# EAGLE schematic p8x-control-card (EAGLE 9.6.2)
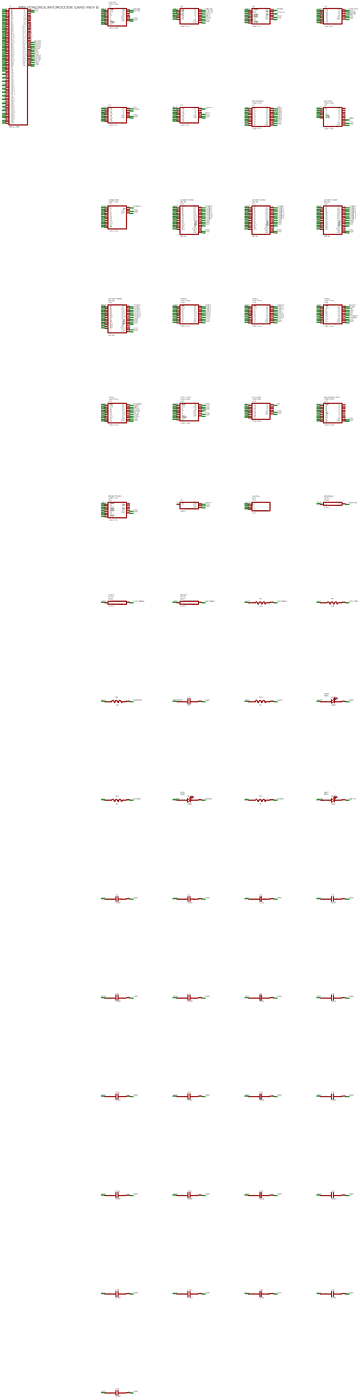
[diagram p0: schematic, sheet 1, overview]
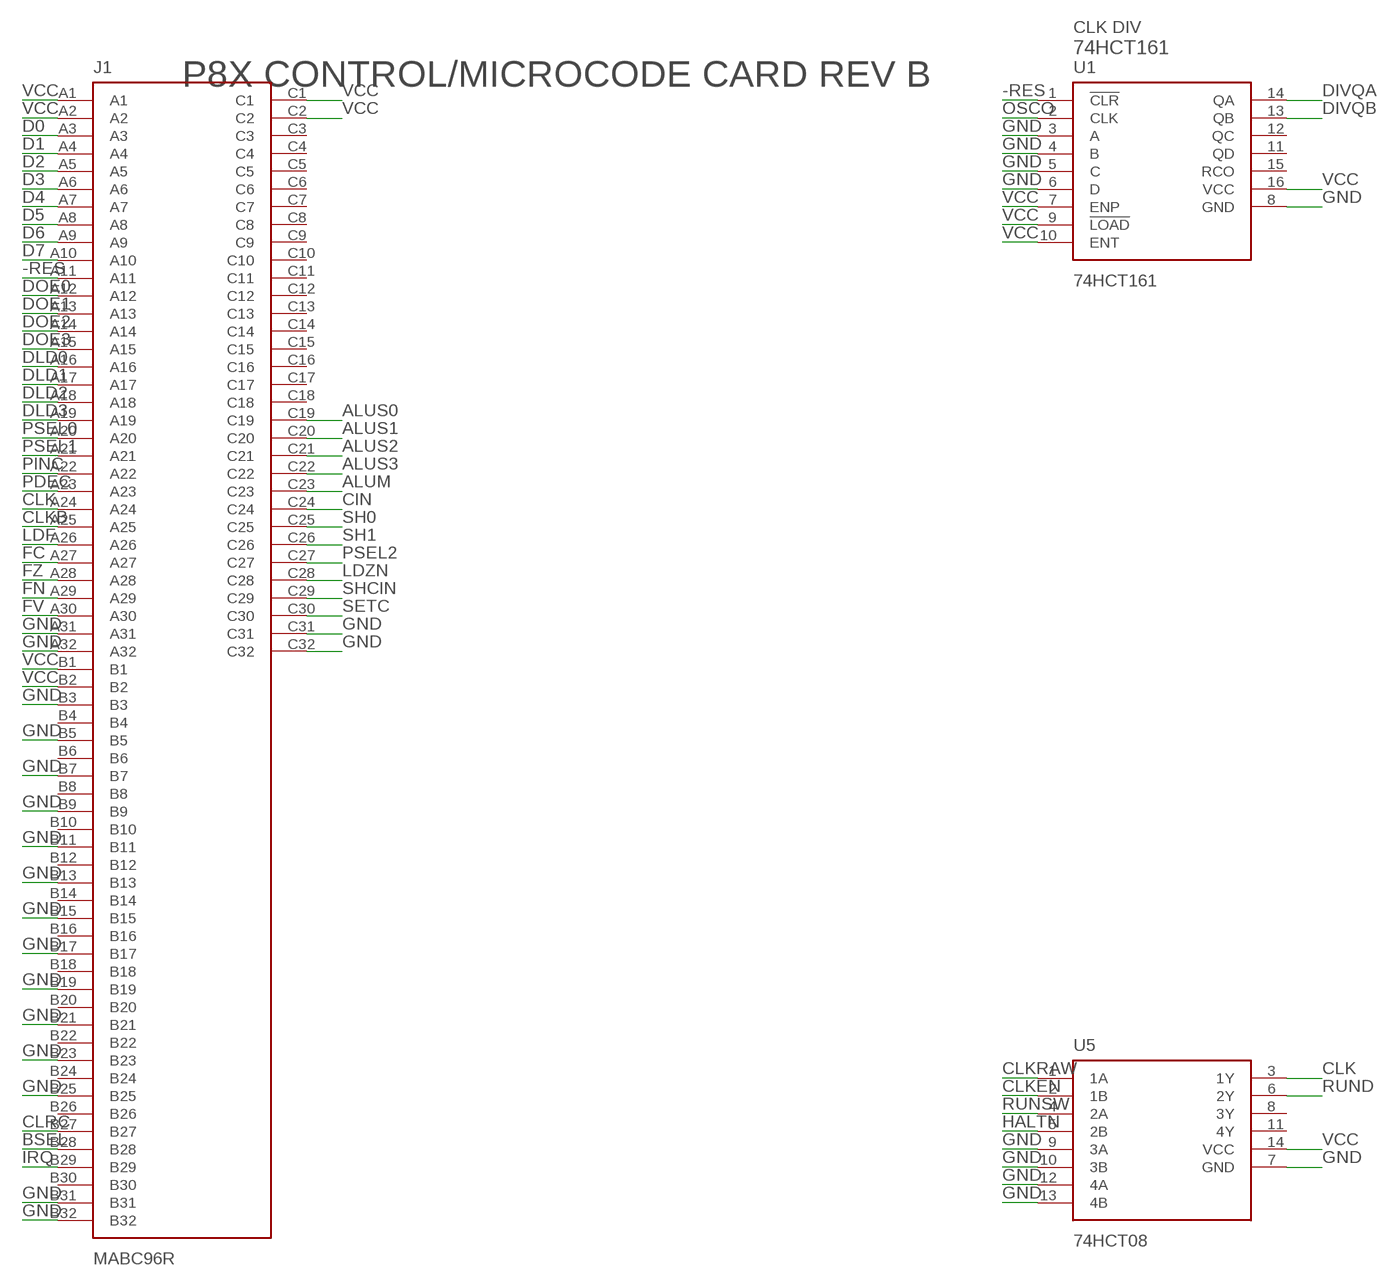
[diagram p1: schematic, sheet 1, part 1 of 6]
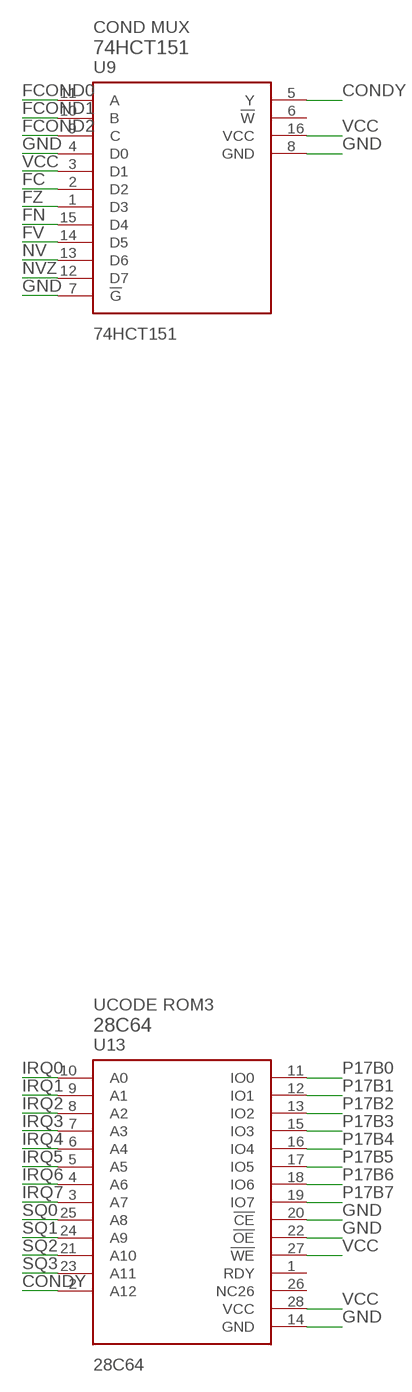
[diagram p2: schematic, sheet 1, part 2 of 6]
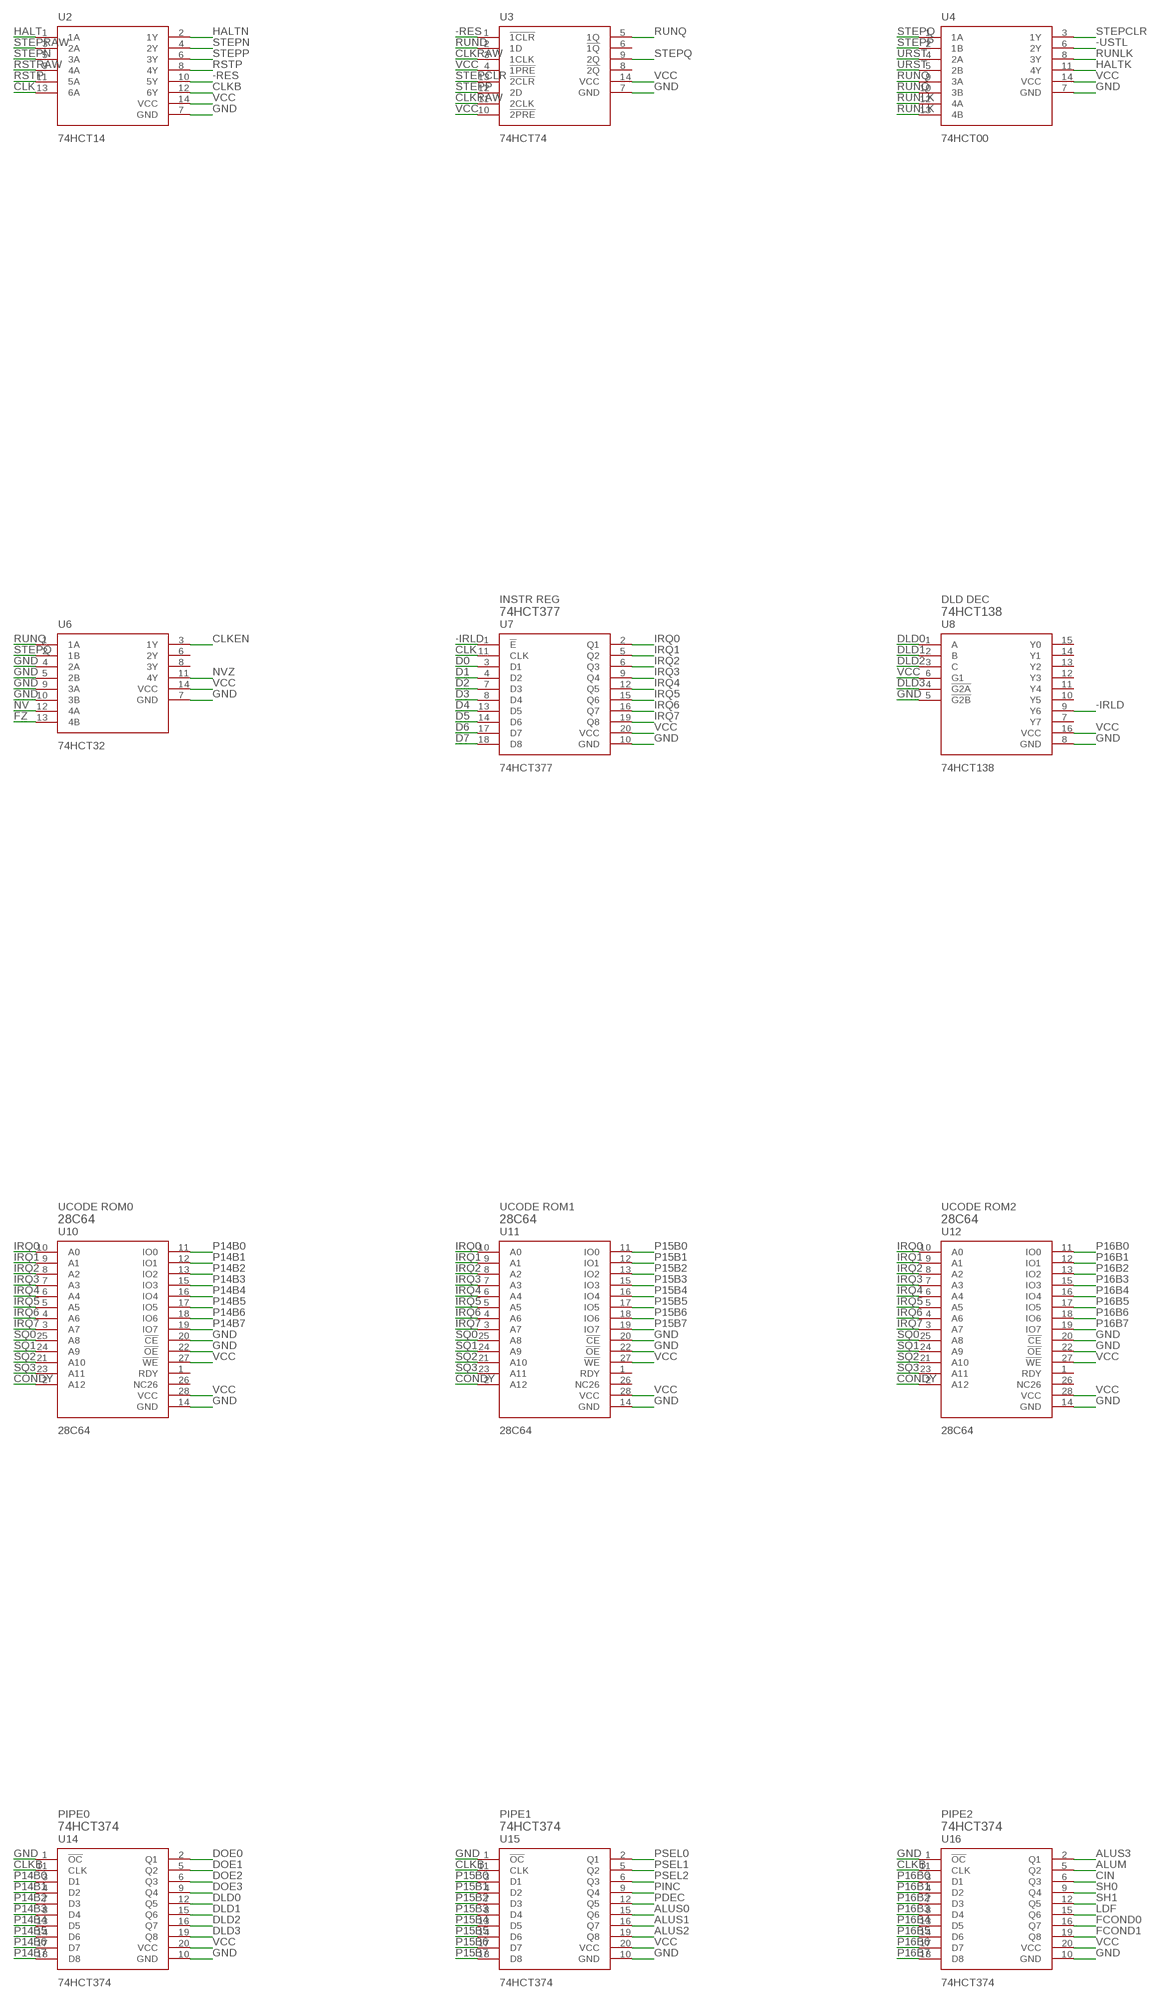
[diagram p3: schematic, sheet 1, part 3 of 6]
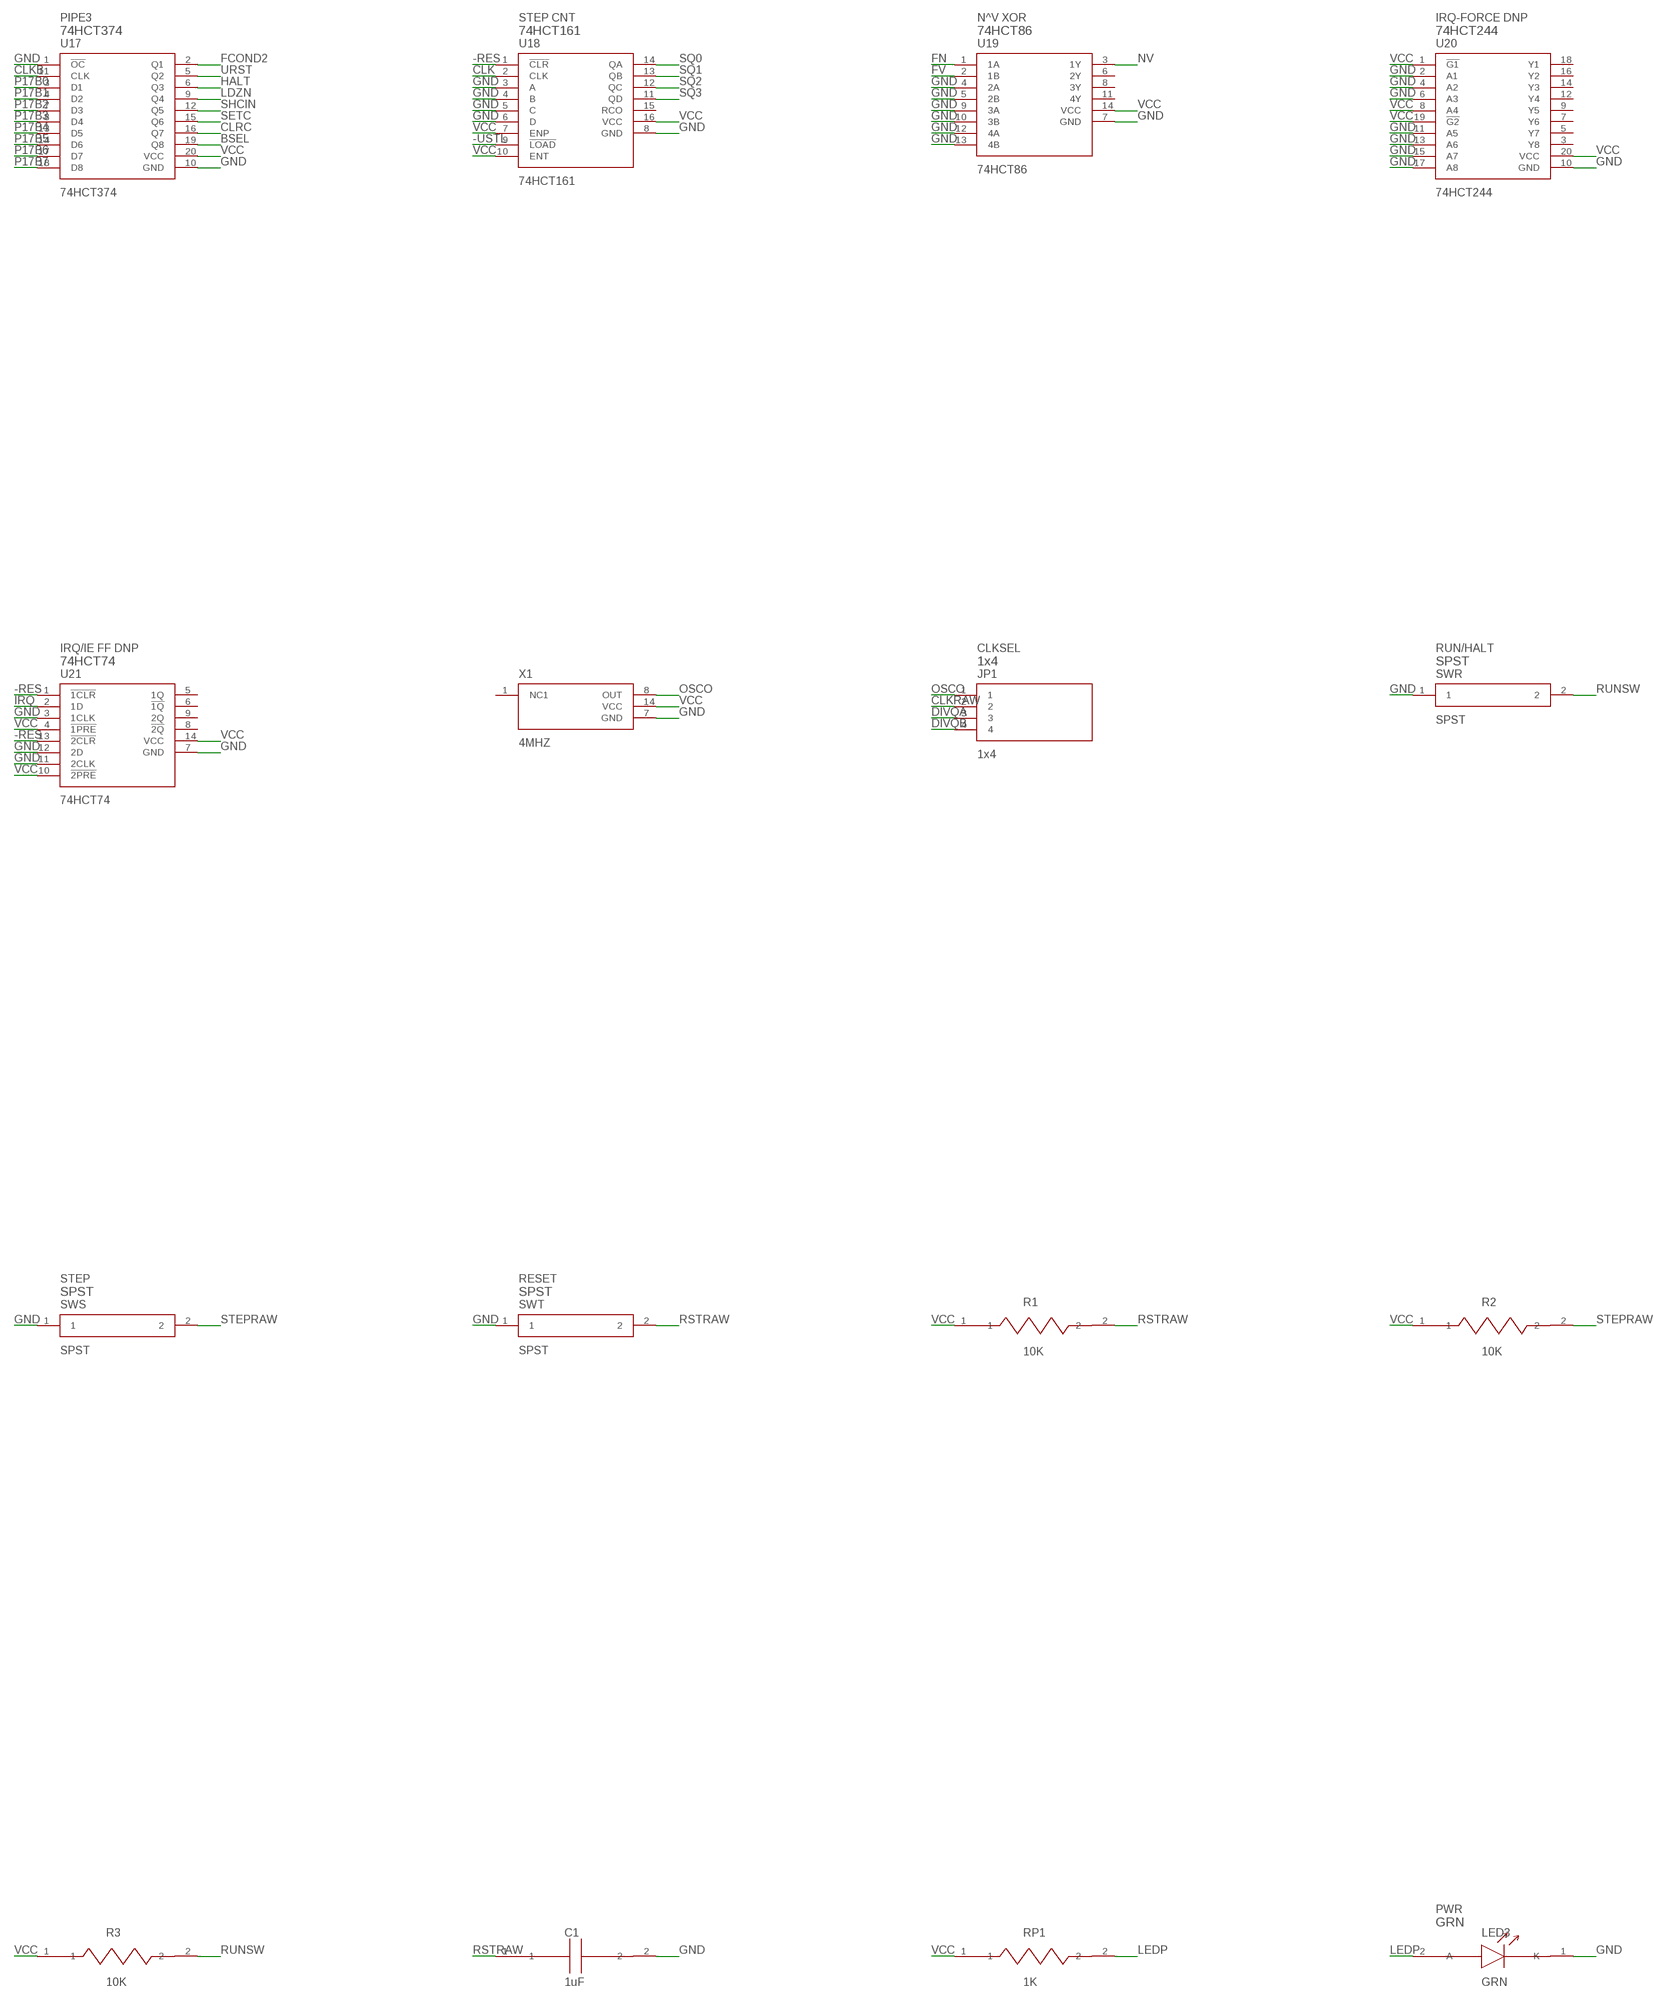
[diagram p4: schematic, sheet 1, part 4 of 6]
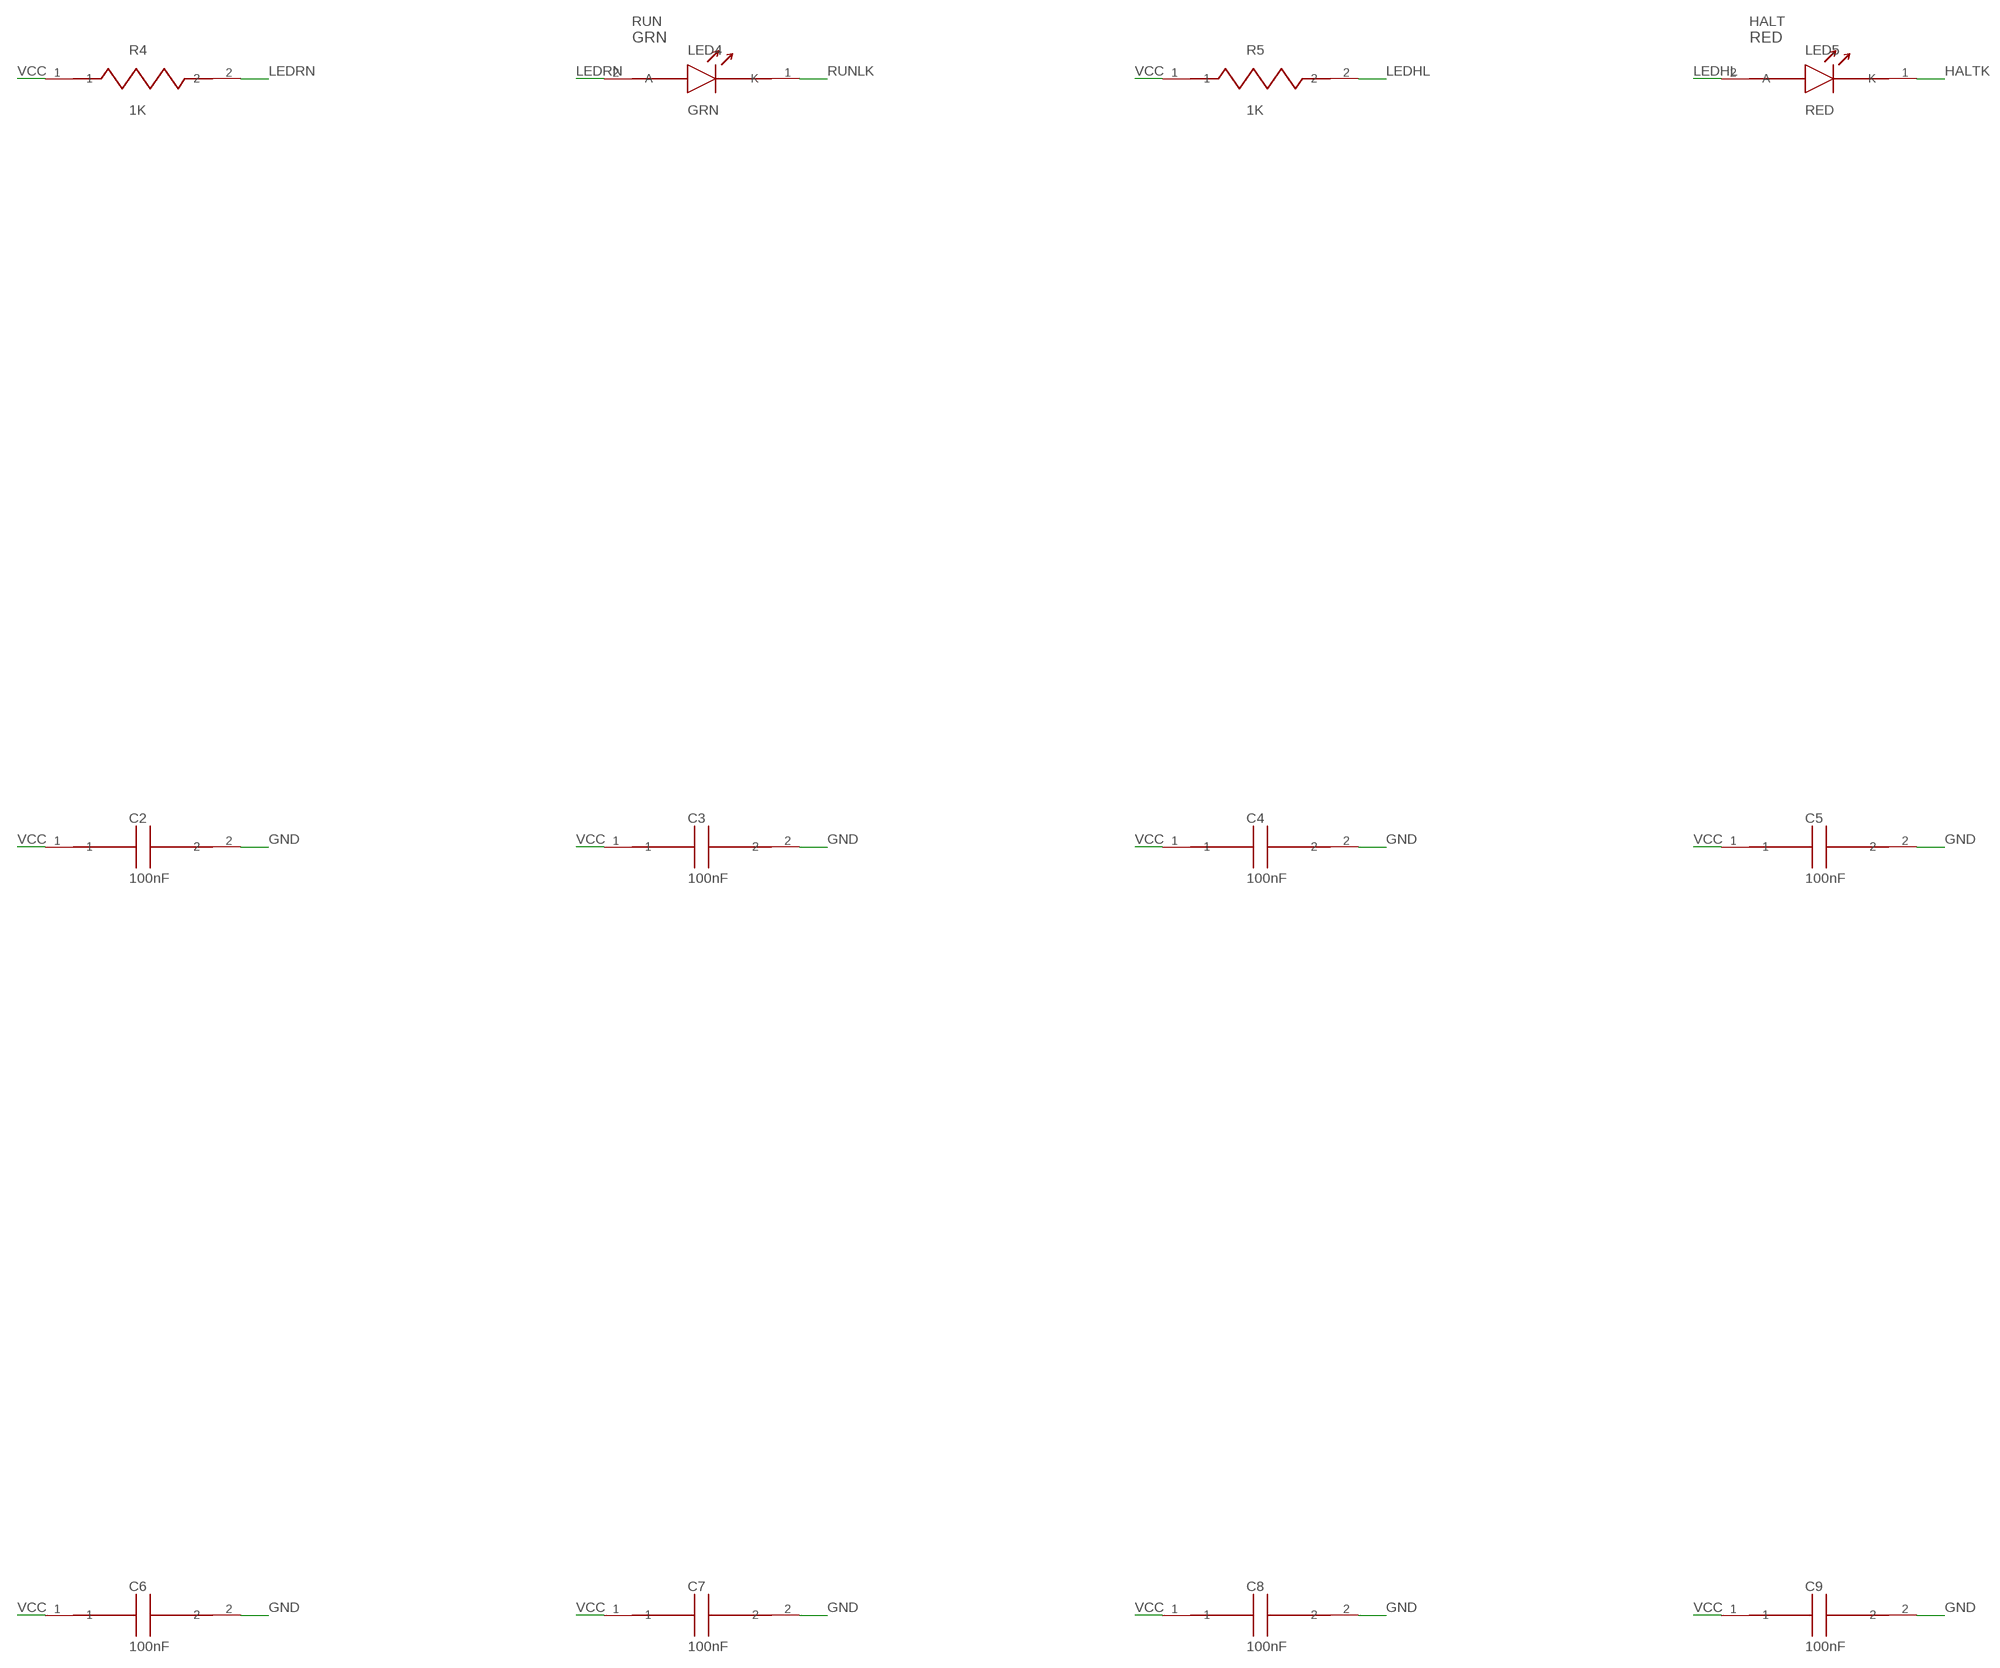
[diagram p5: schematic, sheet 1, part 5 of 6]
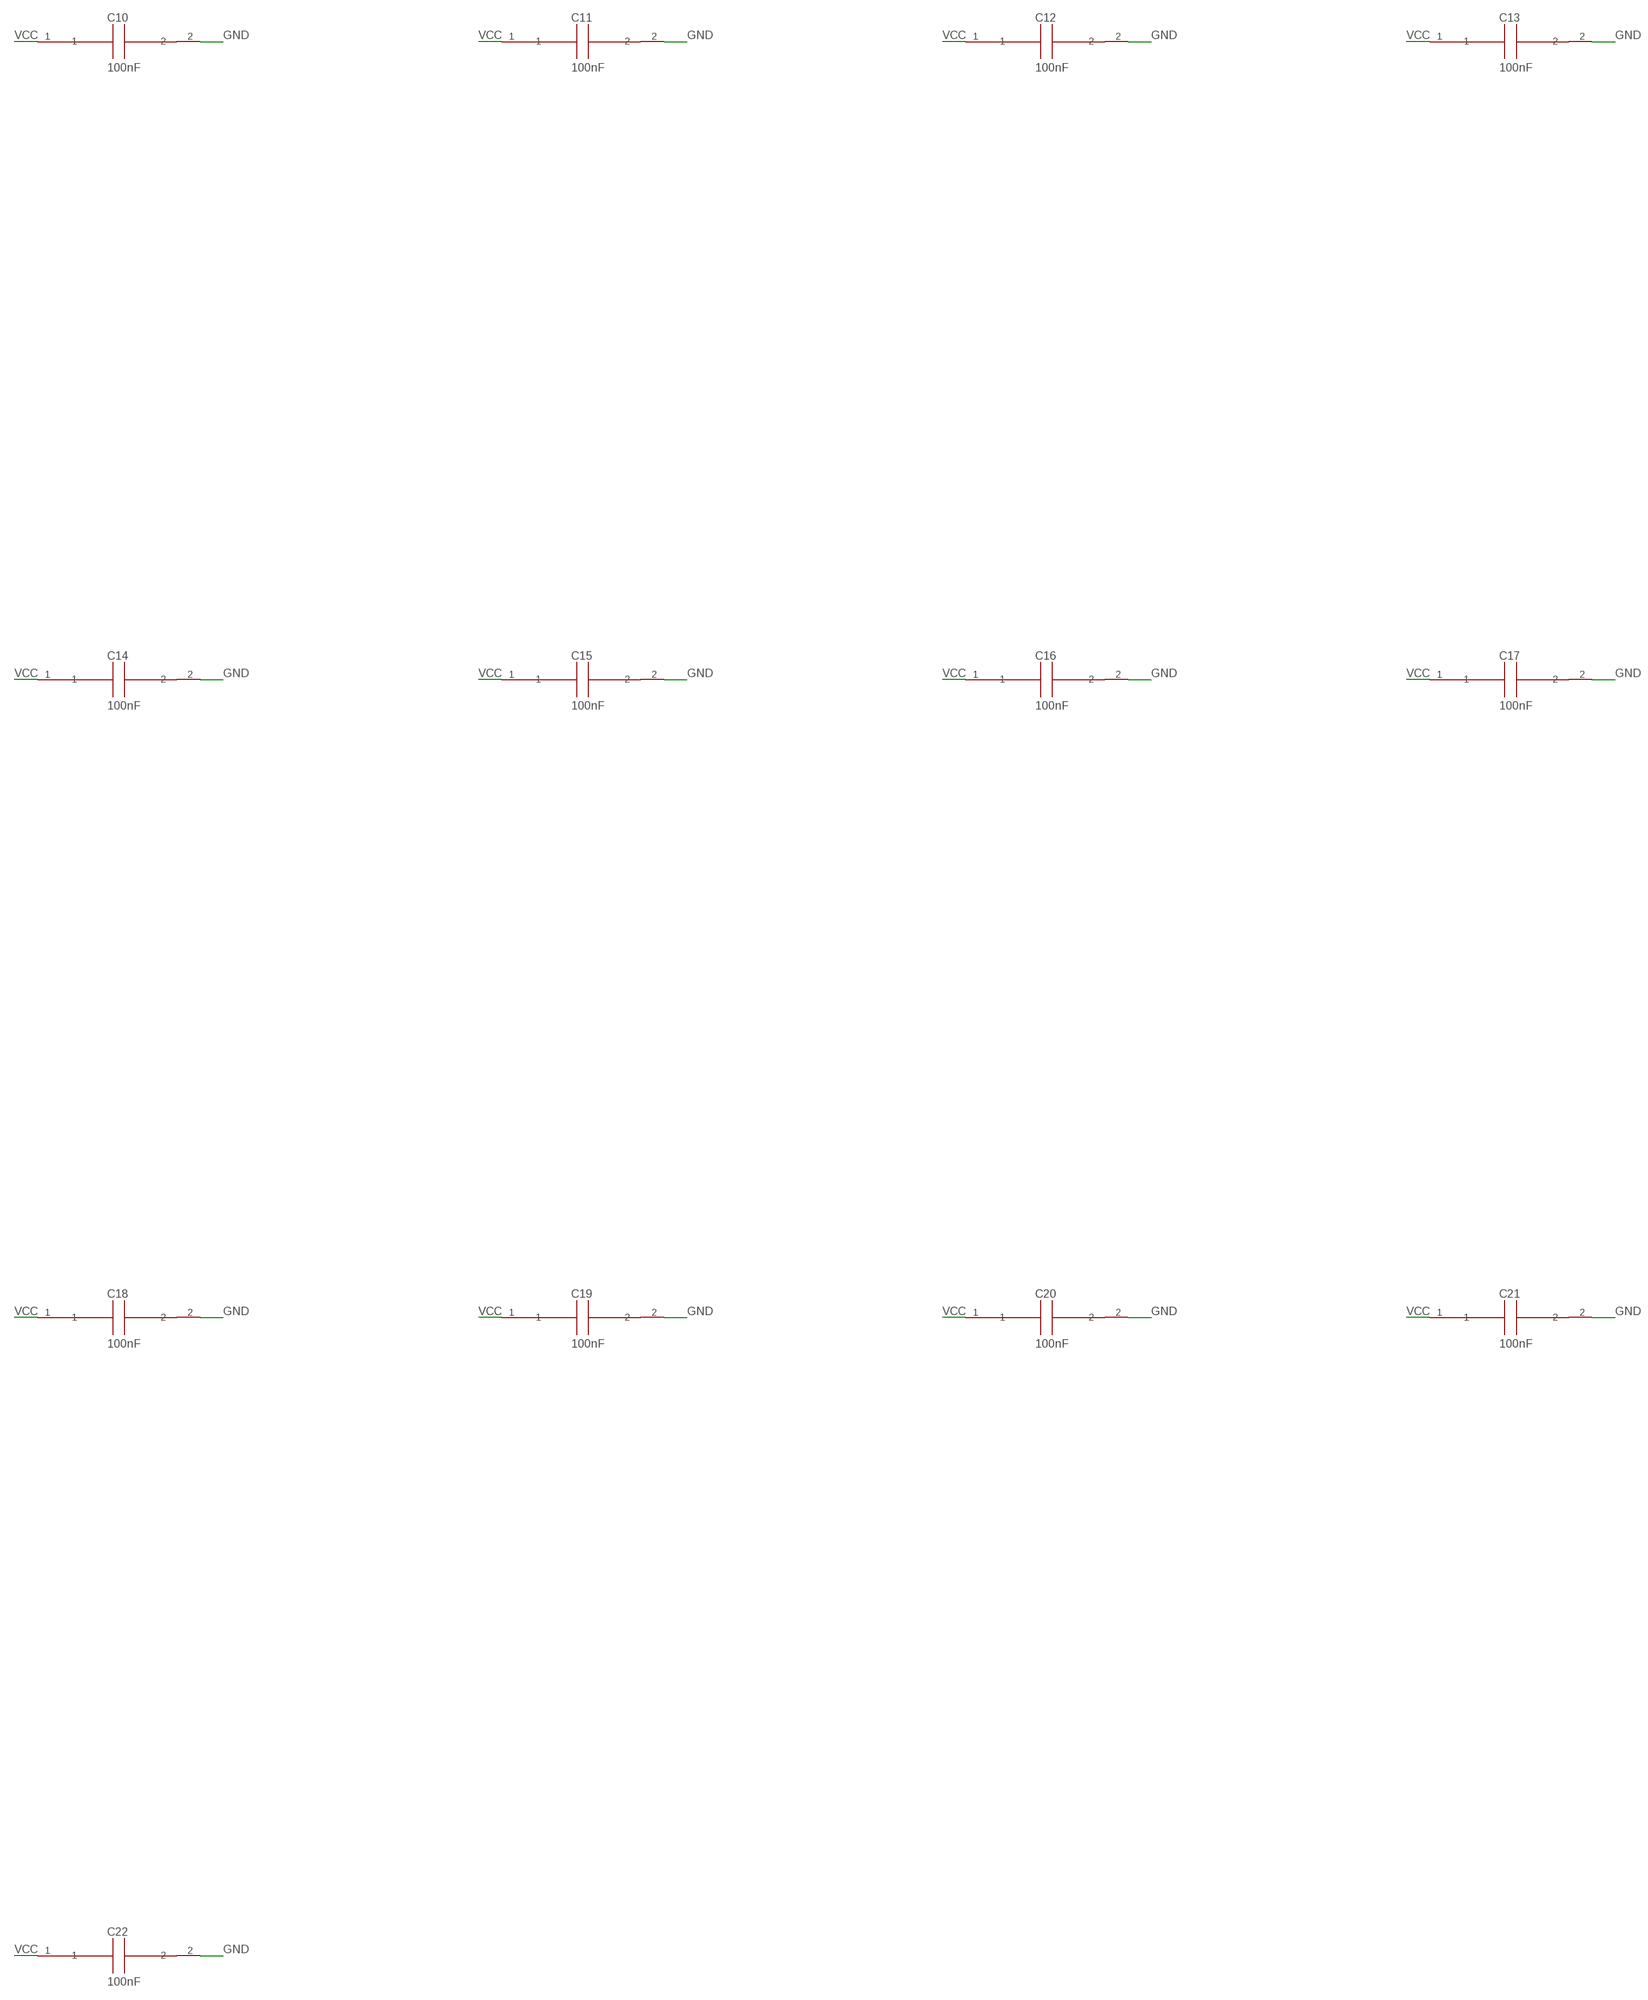
[diagram p6: schematic, sheet 1, part 6 of 6]

## Parts
C1  1uF  CAP  [C_DISC]
C2  100nF  CAP1  [C_DISC1]
C3  100nF  CAP1  [C_DISC1]
C4  100nF  CAP1  [C_DISC1]
C5  100nF  CAP1  [C_DISC1]
C6  100nF  CAP1  [C_DISC1]
C7  100nF  CAP1  [C_DISC1]
C8  100nF  CAP1  [C_DISC1]
C9  100nF  CAP1  [C_DISC1]
C10  100nF  CAP1  [C_DISC1]
C11  100nF  CAP1  [C_DISC1]
C12  100nF  CAP1  [C_DISC1]
C13  100nF  CAP1  [C_DISC1]
C14  100nF  CAP1  [C_DISC1]
C15  100nF  CAP1  [C_DISC1]
C16  100nF  CAP1  [C_DISC1]
C17  100nF  CAP1  [C_DISC1]
C18  100nF  CAP1  [C_DISC1]
C19  100nF  CAP1  [C_DISC1]
C20  100nF  CAP1  [C_DISC1]
C21  100nF  CAP1  [C_DISC1]
C22  100nF  CAP1  [C_DISC1]
J1  MABC96R  DIN96C  [MABC96R]
JP1  1x4  HDR4  [HDR4]
LED3  GRN  LED  [LED5]
LED4  GRN  LED  [LED5]
LED5  RED  LED  [LED5]
R1  10K  RES  [R_AXIAL]
R2  10K  RES  [R_AXIAL]
R3  10K  RES  [R_AXIAL]
R4  1K  RES  [R_AXIAL]
R5  1K  RES  [R_AXIAL]
RP1  1K  RES  [R_AXIAL]
SWR  SPST  SW2  [SW2P]
SWS  SPST  SW2  [SW2P]
SWT  SPST  SW2  [SW2P]
U1  74HCT161  74161  [DIP16]
U2  74HCT14  HEX14  [DIP14]
U3  74HCT74  7474  [DIP14]
U4  74HCT00  GATES14  [DIP14]
U5  74HCT08  GATES14  [DIP14]
U6  74HCT32  GATES14  [DIP14]
U7  74HCT377  74377V2  [DIP20]
U8  74HCT138  74138  [DIP16]
U9  74HCT151  74151  [DIP16]
U10  28C64  [DIP28W]
U11  28C64  [DIP28W]
U12  28C64  [DIP28W]
U13  28C64  [DIP28W]
U14  74HCT374  74374  [DIP20]
U15  74HCT374  74374  [DIP20]
U16  74HCT374  74374  [DIP20]
U17  74HCT374  74374  [DIP20]
U18  74HCT161  74161  [DIP16]
U19  74HCT86  GATES14  [DIP14]
U20  74HCT244  74244  [DIP20]
U21  74HCT74  7474  [DIP14]
X1  4MHZ  OSC  [OSC4]

## Nets
-IRLD: U7.1(!E) U8.9(Y6)
-RES: J1.A11 U1.1(!CLR) U2.10(5Y) U3.1(!1CLR) U18.1(!CLR) U21.1(!1CLR) U21.13(!2CLR)
-USTL: U4.6(2Y) U18.9(!LOAD)
ALUM: J1.C23 U16.5(Q2)
ALUS0: J1.C19 U15.15(Q6)
ALUS1: J1.C20 U15.16(Q7)
ALUS2: J1.C21 U15.19(Q8)
ALUS3: J1.C22 U16.2(Q1)
BSEL: J1.B28 U17.19(Q8)
CIN: J1.C24 U16.6(Q3)
CLK: J1.A24 U2.13(6A) U5.3(1Y) U7.11(CLK) U18.2(CLK)
CLKB: J1.A25 U2.12(6Y) U14.11(CLK) U15.11(CLK) U16.11(CLK) U17.11(CLK)
CLKEN: U5.2(1B) U6.3(1Y)
CLKRAW: JP1.2 U3.3(1CLK) U3.11(2CLK) U5.1(1A)
CLRC: J1.B27 U17.16(Q7)
CONDY: U9.5(Y) U10.2(A12) U11.2(A12) U12.2(A12) U13.2(A12)
D0: J1.A3 U7.3(D1)
D1: J1.A4 U7.4(D2)
D2: J1.A5 U7.7(D3)
D3: J1.A6 U7.8(D4)
D4: J1.A7 U7.13(D5)
D5: J1.A8 U7.14(D6)
D6: J1.A9 U7.17(D7)
D7: J1.A10 U7.18(D8)
DIVQA: JP1.3 U1.14(QA)
DIVQB: JP1.4 U1.13(QB)
DLD0: J1.A16 U8.1(A) U14.12(Q5)
DLD1: J1.A17 U8.2(B) U14.15(Q6)
DLD2: J1.A18 U8.3(C) U14.16(Q7)
DLD3: J1.A19 U8.4(!G2A) U14.19(Q8)
DOE0: J1.A12 U14.2(Q1)
DOE1: J1.A13 U14.5(Q2)
DOE2: J1.A14 U14.6(Q3)
DOE3: J1.A15 U14.9(Q4)
FC: J1.A27 U9.2(D2)
FCOND0: U9.11(A) U16.16(Q7)
FCOND1: U9.10(B) U16.19(Q8)
FCOND2: U9.9(C) U17.2(Q1)
FN: J1.A29 U9.15(D4) U19.1(1A)
FV: J1.A30 U9.14(D5) U19.2(1B)
FZ: J1.A28 U6.13(4B) U9.1(D3)
GND: C1.2 C2.2 C3.2 C4.2 C5.2 C6.2 C7.2 C8.2 C9.2 C10.2 C11.2 C12.2 C13.2 C14.2 C15.2 C16.2 C17.2 C18.2 C19.2 C20.2 C21.2 C22.2 J1.A31 J1.A32 J1.B3 J1.B5 J1.B7 J1.B9 J1.B11 J1.B13 J1.B15 J1.B17 J1.B19 J1.B21 J1.B23 J1.B25 J1.B31 J1.B32 J1.C31 J1.C32 LED3.1(K) SWR.1 SWS.1 SWT.1 U1.3(A) U1.4(B) U1.5(C) U1.6(D) U1.8(GND) U2.7(GND) U3.7(GND) U4.7(GND) U5.7(GND) U5.9(3A) U5.10(3B) U5.12(4A) U5.13(4B) U6.4(2A) U6.5(2B) U6.7(GND) U6.9(3A) U6.10(3B) U7.10(GND) U8.5(!G2B) U8.8(GND) U9.4(D0) U9.7(!G) U9.8(GND) U10.14(GND) U10.20(!CE) U10.22(!OE) U11.14(GND) U11.20(!CE) U11.22(!OE) U12.14(GND) U12.20(!CE) U12.22(!OE) U13.14(GND) U13.20(!CE) U13.22(!OE) U14.1(!OC) U14.10(GND) U15.1(!OC) U15.10(GND) U16.1(!OC) U16.10(GND) U17.1(!OC) U17.10(GND) U18.3(A) U18.4(B) U18.5(C) U18.6(D) U18.8(GND) U19.4(2A) U19.5(2B) U19.7(GND) U19.9(3A) U19.10(3B) U19.12(4A) U19.13(4B) U20.2(A1) U20.4(A2) U20.6(A3) U20.10(GND) U20.11(A5) U20.13(A6) U20.15(A7) U20.17(A8) U21.3(1CLK) U21.7(GND) U21.11(2CLK) U21.12(2D) X1.7(GND)
HALT: U2.1(1A) U17.6(Q3)
HALTK: LED5.1(K) U4.11(4Y)
HALTN: U2.2(1Y) U5.5(2B)
IRQ: J1.B29 U21.2(1D)
IRQ0: U7.2(Q1) U10.10(A0) U11.10(A0) U12.10(A0) U13.10(A0)
IRQ1: U7.5(Q2) U10.9(A1) U11.9(A1) U12.9(A1) U13.9(A1)
IRQ2: U7.6(Q3) U10.8(A2) U11.8(A2) U12.8(A2) U13.8(A2)
IRQ3: U7.9(Q4) U10.7(A3) U11.7(A3) U12.7(A3) U13.7(A3)
IRQ4: U7.12(Q5) U10.6(A4) U11.6(A4) U12.6(A4) U13.6(A4)
IRQ5: U7.15(Q6) U10.5(A5) U11.5(A5) U12.5(A5) U13.5(A5)
IRQ6: U7.16(Q7) U10.4(A6) U11.4(A6) U12.4(A6) U13.4(A6)
IRQ7: U7.19(Q8) U10.3(A7) U11.3(A7) U12.3(A7) U13.3(A7)
LDF: J1.A26 U16.15(Q6)
LDZN: J1.C28 U17.9(Q4)
LEDHL: LED5.2(A) R5.2
LEDP: LED3.2(A) RP1.2
LEDRN: LED4.2(A) R4.2
NV: U6.12(4A) U9.13(D6) U19.3(1Y)
NVZ: U6.11(4Y) U9.12(D7)
OSCO: JP1.1 U1.2(CLK) X1.8(OUT)
P14B0: U10.11(IO0) U14.3(D1)
P14B1: U10.12(IO1) U14.4(D2)
P14B2: U10.13(IO2) U14.7(D3)
P14B3: U10.15(IO3) U14.8(D4)
P14B4: U10.16(IO4) U14.13(D5)
P14B5: U10.17(IO5) U14.14(D6)
P14B6: U10.18(IO6) U14.17(D7)
P14B7: U10.19(IO7) U14.18(D8)
P15B0: U11.11(IO0) U15.3(D1)
P15B1: U11.12(IO1) U15.4(D2)
P15B2: U11.13(IO2) U15.7(D3)
P15B3: U11.15(IO3) U15.8(D4)
P15B4: U11.16(IO4) U15.13(D5)
P15B5: U11.17(IO5) U15.14(D6)
P15B6: U11.18(IO6) U15.17(D7)
P15B7: U11.19(IO7) U15.18(D8)
P16B0: U12.11(IO0) U16.3(D1)
P16B1: U12.12(IO1) U16.4(D2)
P16B2: U12.13(IO2) U16.7(D3)
P16B3: U12.15(IO3) U16.8(D4)
P16B4: U12.16(IO4) U16.13(D5)
P16B5: U12.17(IO5) U16.14(D6)
P16B6: U12.18(IO6) U16.17(D7)
P16B7: U12.19(IO7) U16.18(D8)
P17B0: U13.11(IO0) U17.3(D1)
P17B1: U13.12(IO1) U17.4(D2)
P17B2: U13.13(IO2) U17.7(D3)
P17B3: U13.15(IO3) U17.8(D4)
P17B4: U13.16(IO4) U17.13(D5)
P17B5: U13.17(IO5) U17.14(D6)
P17B6: U13.18(IO6) U17.17(D7)
P17B7: U13.19(IO7) U17.18(D8)
PDEC: J1.A23 U15.12(Q5)
PINC: J1.A22 U15.9(Q4)
PSEL0: J1.A20 U15.2(Q1)
PSEL1: J1.A21 U15.5(Q2)
PSEL2: J1.C27 U15.6(Q3)
RSTP: U2.8(4Y) U2.11(5A)
RSTRAW: C1.1 R1.2 SWT.2 U2.9(4A)
RUND: U3.2(1D) U5.6(2Y)
RUNLK: LED4.1(K) U4.8(3Y) U4.12(4A) U4.13(4B)
RUNQ: U3.5(1Q) U4.9(3A) U4.10(3B) U6.1(1A)
RUNSW: R3.2 SWR.2 U5.4(2A)
SETC: J1.C30 U17.15(Q6)
SH0: J1.C25 U16.9(Q4)
SH1: J1.C26 U16.12(Q5)
SHCIN: J1.C29 U17.12(Q5)
SQ0: U10.25(A8) U11.25(A8) U12.25(A8) U13.25(A8) U18.14(QA)
SQ1: U10.24(A9) U11.24(A9) U12.24(A9) U13.24(A9) U18.13(QB)
SQ2: U10.21(A10) U11.21(A10) U12.21(A10) U13.21(A10) U18.12(QC)
SQ3: U10.23(A11) U11.23(A11) U12.23(A11) U13.23(A11) U18.11(QD)
STEPCLR: U3.13(!2CLR) U4.3(1Y)
STEPN: U2.4(2Y) U2.5(3A)
STEPP: U2.6(3Y) U3.12(2D) U4.2(1B)
STEPQ: U3.9(2Q) U4.1(1A) U6.2(1B)
STEPRAW: R2.2 SWS.2 U2.3(2A)
URST: U4.4(2A) U4.5(2B) U17.5(Q2)
VCC: C2.1 C3.1 C4.1 C5.1 C6.1 C7.1 C8.1 C9.1 C10.1 C11.1 C12.1 C13.1 C14.1 C15.1 C16.1 C17.1 C18.1 C19.1 C20.1 C21.1 C22.1 J1.A1 J1.A2 J1.B1 J1.B2 J1.C1 J1.C2 R1.1 R2.1 R3.1 R4.1 R5.1 RP1.1 U1.7(ENP) U1.9(!LOAD) U1.10(ENT) U1.16(VCC) U2.14(VCC) U3.4(!1PRE) U3.10(!2PRE) U3.14(VCC) U4.14(VCC) U5.14(VCC) U6.14(VCC) U7.20(VCC) U8.6(G1) U8.16(VCC) U9.3(D1) U9.16(VCC) U10.27(!WE) U10.28(VCC) U11.27(!WE) U11.28(VCC) U12.27(!WE) U12.28(VCC) U13.27(!WE) U13.28(VCC) U14.20(VCC) U15.20(VCC) U16.20(VCC) U17.20(VCC) U18.7(ENP) U18.10(ENT) U18.16(VCC) U19.14(VCC) U20.1(!G1) U20.8(A4) U20.19(!G2) U20.20(VCC) U21.4(!1PRE) U21.10(!2PRE) U21.14(VCC) X1.14(VCC)
Unconnected: J1.B4 J1.B6 J1.B8 J1.B10 J1.B12 J1.B14 J1.B16 J1.B18 J1.B20 J1.B22 J1.B24 J1.B26 J1.B30 J1.C3 J1.C4 J1.C5 J1.C6 J1.C7 J1.C8 J1.C9 J1.C10 J1.C11 J1.C12 J1.C13 J1.C14 J1.C15 J1.C16 J1.C17 J1.C18 U1.11(QD) U1.12(QC) U1.15(RCO) U3.6(!1Q) U3.8(!2Q) U5.8(3Y) U5.11(4Y) U6.6(2Y) U6.8(3Y) U8.7(Y7) U8.10(Y5) U8.11(Y4) U8.12(Y3) U8.13(Y2) U8.14(Y1) U8.15(Y0) U9.6(!W) U10.1(RDY) U10.26(NC26) U11.1(RDY) U11.26(NC26) U12.1(RDY) U12.26(NC26) U13.1(RDY) U13.26(NC26) U18.15(RCO) U19.6(2Y) U19.8(3Y) U19.11(4Y) U20.3(Y8) U20.5(Y7) U20.7(Y6) U20.9(Y5) U20.12(Y4) U20.14(Y3) U20.16(Y2) U20.18(Y1) U21.5(1Q) U21.6(!1Q) U21.8(!2Q) U21.9(2Q) X1.1(NC1)

## Notes on the sheet
- CLK DIV
- 74HCT161
- P8X CONTROL/MICROCODE CARD REV B
- INSTR REG | DLD DEC
- 74HCT377 | 74HCT138
- COND MUX | UCODE ROM0 | UCODE ROM1 | UCODE ROM2
- 74HCT151 | 28C64 | 28C64 | 28C64
- UCODE ROM3 | PIPE0 | PIPE1 | PIPE2
- 28C64 | 74HCT374 | 74HCT374 | 74HCT374
- PIPE3 | STEP CNT | N^V XOR | IRQ-FORCE DNP
- 74HCT374 | 74HCT161 | 74HCT86 | 74HCT244
- IRQ/IE FF DNP | CLKSEL | RUN/HALT
- 74HCT74 | 1x4 | SPST
- STEP | RESET
- SPST | SPST
- PWR
- GRN
- RUN | HALT
- GRN | RED

## Library data of the parts
C1 = p8x:CAP
C2-C22 = p8x:CAP1
J1 = p8x:DIN96C
JP1 = p8x:HDR4
LED3-LED5 = p8x:LED
R1-R5 RP1 = p8x:RES
SWR SWS SWT = p8x:SW2
U1 U18 = p8x:74161
U2 = p8x:HEX14
U3 U21 = p8x:7474
U4-U6 U19 = p8x:GATES14
U7 = p8x:74377V2
U8 = p8x:74138
U9 = p8x:74151
U10-U13 = p8x:28C64
U14-U17 = p8x:74374
U20 = p8x:74244
X1 = p8x:OSC